# EasyEDA schematic 1-Schematic_CessnaCitationX_PilotBoard.json
TITLE: PILOT PANEL; REV: 2.0; Date: 2018-11-17; Sheet: 1/1; Drawn By: F-ORKI
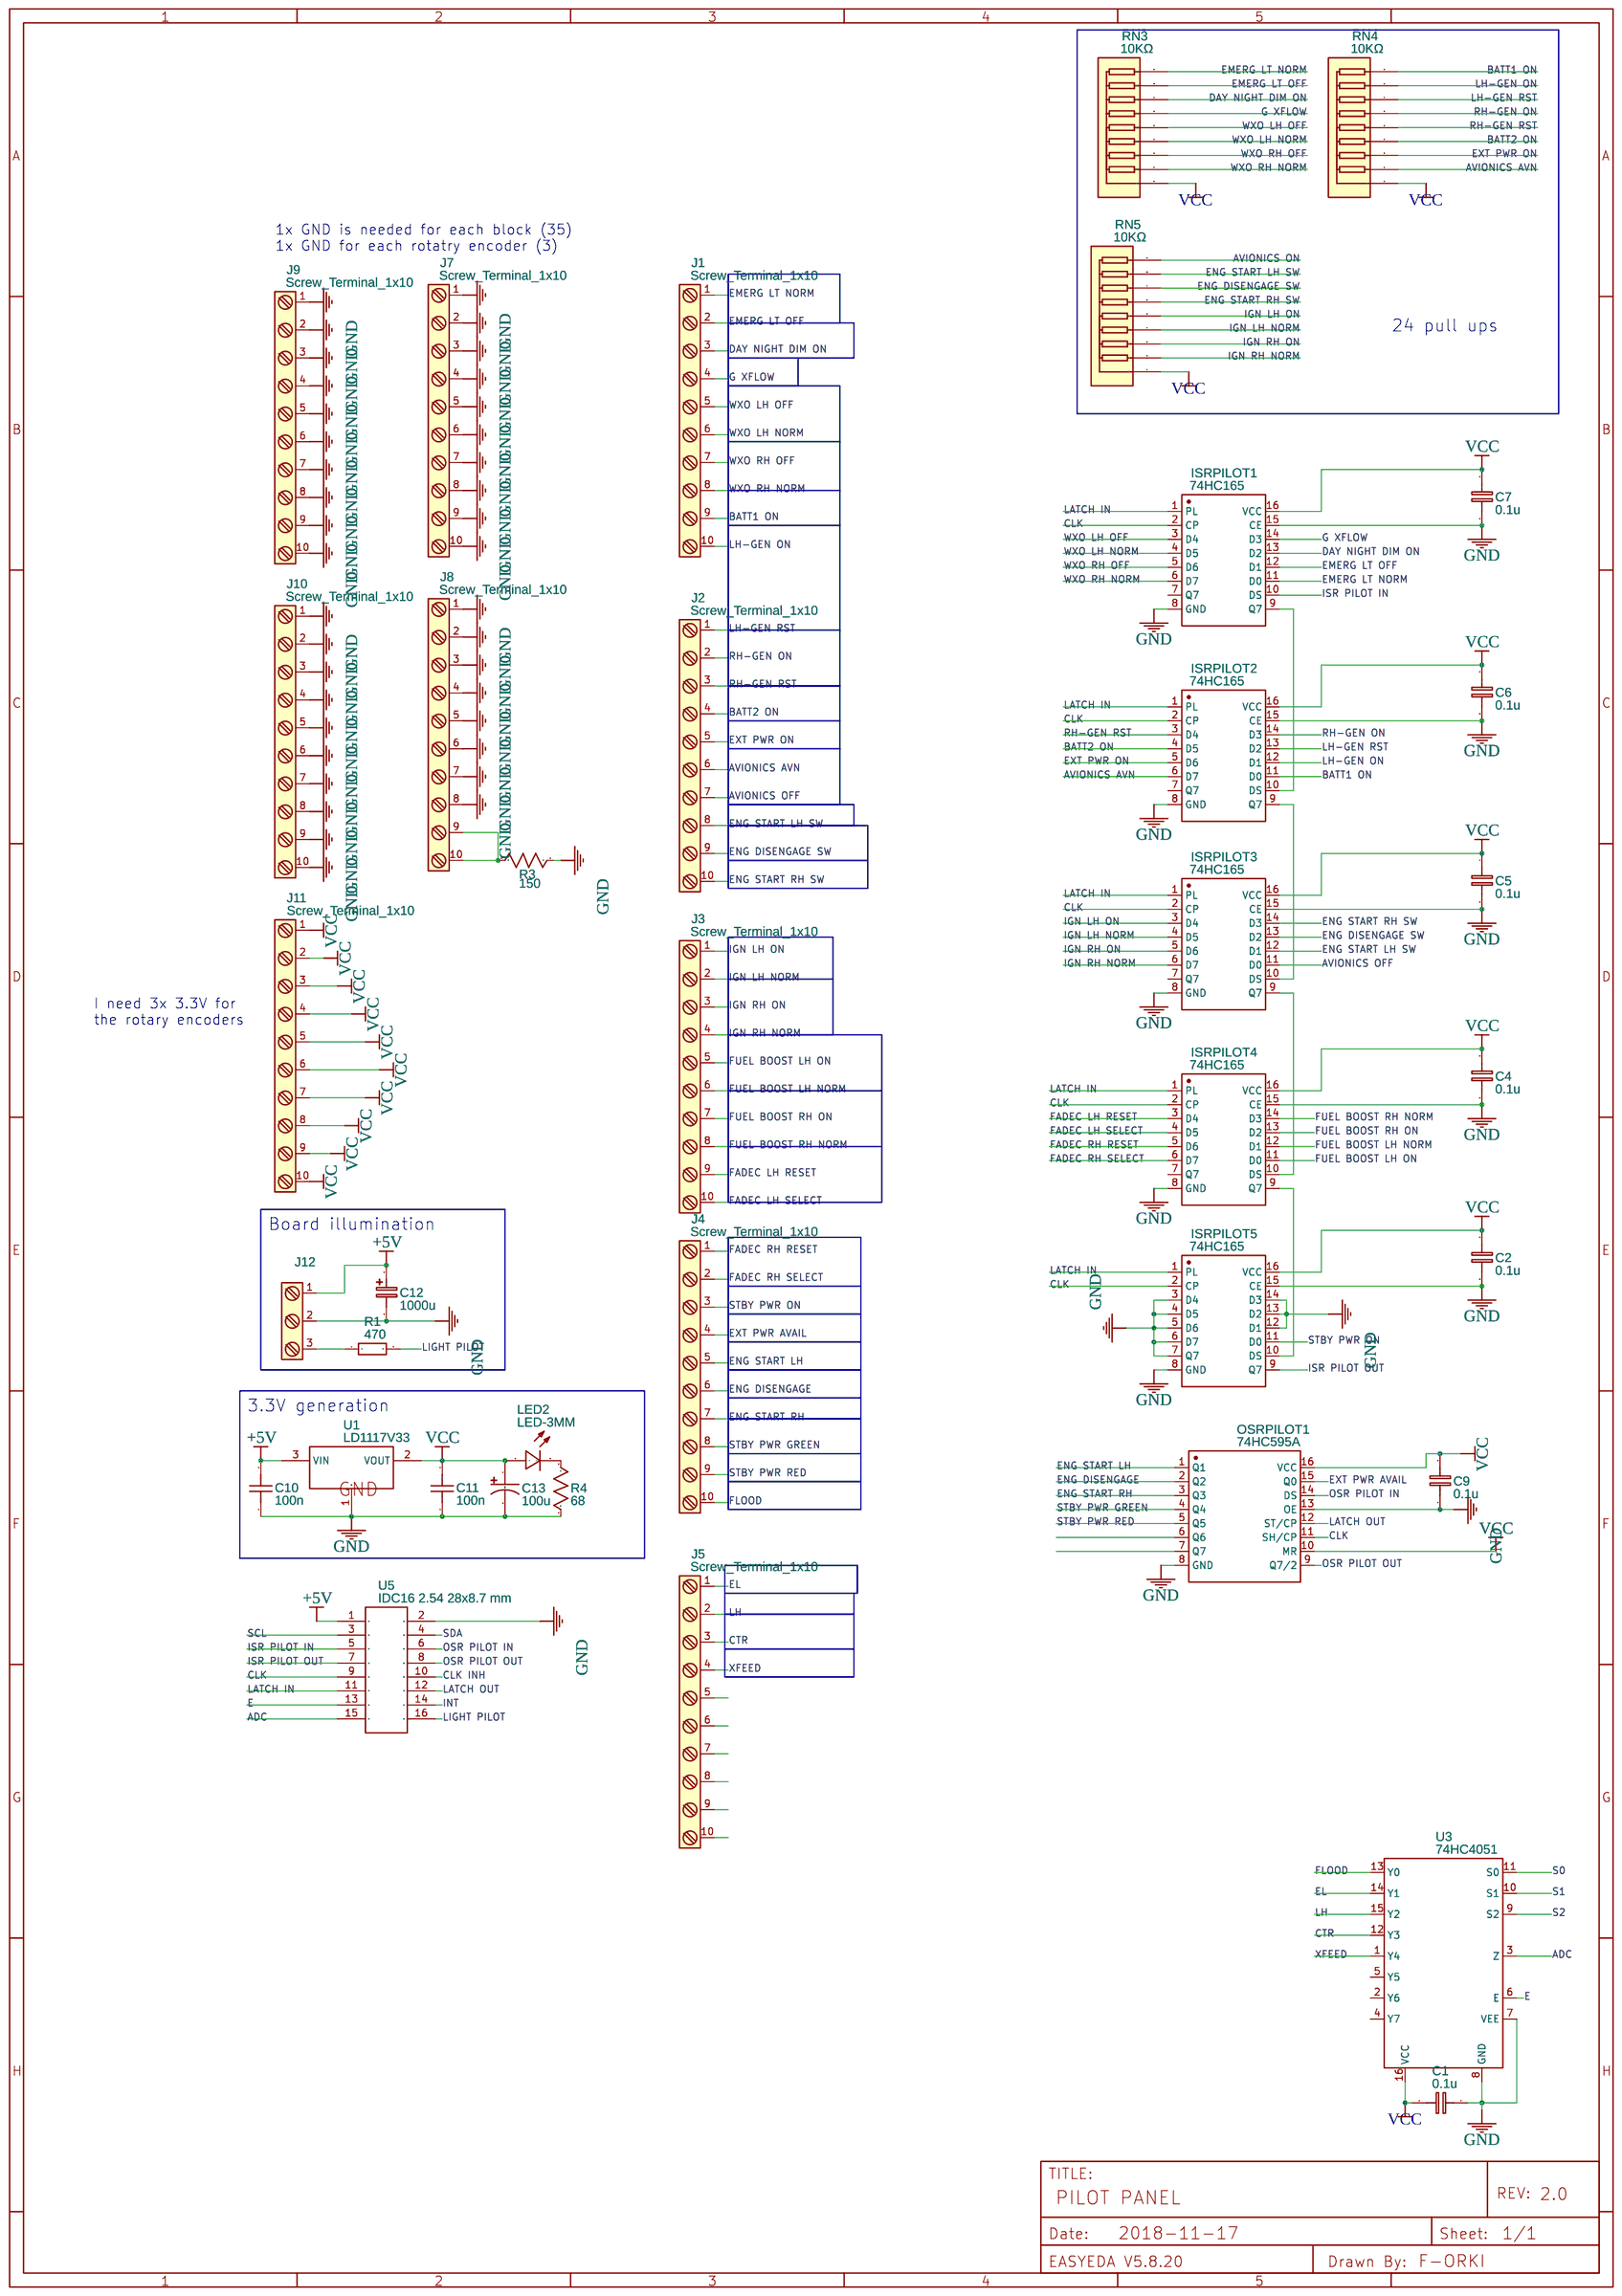
[diagram p0: schematic sheet]

## Parts
C1  0.1u  [RAD-0.1]
C2  0.1u  [RAD-0.1]
C4  0.1u  [RAD-0.1]
C5  0.1u  [RAD-0.1]
C6  0.1u  [RAD-0.1]
C7  0.1u  [RAD-0.1]
C9  0.1u  [RAD-0.1]
C10  100n  [RAD-0.1]
C11  100n  [RAD-0.1]
C12  1000u  [CAP-D3.0XF1.5]
C13  100u  [CAP-D3.0XF1.5]
ISRPILOT1  74HC165  [DIP16]
ISRPILOT2  74HC165  [DIP16]
ISRPILOT3  74HC165  [DIP16]
ISRPILOT4  74HC165  [DIP16]
ISRPILOT5  74HC165  [DIP16]
J1  Screw_Terminal_1x10  [TERMINALBLOCK_PHEONIX_MPT-2.54MM_10POL]
J2  Screw_Terminal_1x10  [TERMINALBLOCK_PHEONIX_MPT-2.54MM_10POL]
J3  Screw_Terminal_1x10  [TERMINALBLOCK_PHEONIX_MPT-2.54MM_10POL]
J4  Screw_Terminal_1x10  [TERMINALBLOCK_PHEONIX_MPT-2.54MM_10POL]
J5  Screw_Terminal_1x10  [TERMINALBLOCK_PHEONIX_MPT-2.54MM_10POL]
J7  Screw_Terminal_1x10  [TERMINALBLOCK_PHEONIX_MPT-2.54MM_10POL]
J8  Screw_Terminal_1x10  [TERMINALBLOCK_PHEONIX_MPT-2.54MM_10POL]
J9  Screw_Terminal_1x10  [TERMINALBLOCK_PHEONIX_MPT-2.54MM_10POL]
J10  Screw_Terminal_1x10  [TERMINALBLOCK_PHEONIX_MPT-2.54MM_10POL]
J11  Screw_Terminal_1x10  [TERMINALBLOCK_PHEONIX_MPT-2.54MM_10POL]
J12  Screw_Terminal_1x03  [TERMINALBLOCK_PHEONIX_MPT-2.54MM_3POL]
LED2  LED-3MM  [LED-3MM/2.54]
OSRPILOT1  74HC595A  [DIP-16]
R1  470  [AXIAL-0.3]
R3  150  [AXIAL-0.3]
R4  68  [AXIAL-0.3]
RN3  10KΩ  [SIP-9]
RN4  10KΩ  [SIP-9]
RN5  10KΩ  [SIP-9]
U1  LD1117V33  [TO-220(TO-220-3)]
U3  74HC4051  [DIL16-O]
U5  IDC16 2.54 28x8.7 mm  [IDC16 2.54 28X8.7 MM]

## Library data of the parts
C1 C2 C4-C7 C9 = Cap_RAD-0.1_EU: Manufacturer Part: ?
C10 C11 = Cap_RAD-0.1_US: Manufacturer Part: ?
C12 = Cap_Electrolytic(TH)_D3.0XF1.5_EU: Contributor: EasyEDA; Manufacturer Part: ?
C13 = Cap_Electrolytic(TH)_D3.0XF1.5_US: Manufacturer Part: ?
ISRPILOT1-ISRPILOT4 = -: Supplier: LCSC; Manufacturer: Nexperia; Manufacturer Part: 74HC165D,653; LCSC Assembly: Yes; image: //image.lceda.cn/szlcsc/C5613.jpg; Contributor: LCSC; Supplier Part: C5613
ISRPILOT5 = -: Supplier: LCSC; Manufacturer: Nexperia; Manufacturer Part: 74HC165D,653; LCSC Assembly: Yes; image: //image.lceda.cn/szlcsc/C5613.jpg; Contributor: LCSC; Supplier Part: C5613; Package Display: No
J1-J5 J7-J12 = -: Contributor: KiCAD; license: https://www.gnu.org/licenses/lgpl-2.1.html; Manufacturer Part: ?
LED2 = -: Supplier: LCSC; Manufacturer: EVERLIGHT; Manufacturer Part: 204-10SURD/S530-A3; Supplier Part: C99772
OSRPILOT1 = -: Supplier: LCSC; Manufacturer: FM; Contributor: LCSC; Supplier Part: C110383
R1 = Res_AXIAL-0.3(1/8W)_EU: Manufacturer Part: ?
R3 R4 = Res_AXIAL-0.3(1/8W)_US: Manufacturer Part: ?
RN3-RN5 = A09-103JP: Supplier: LCSC; Manufacturer: FH; Contributor: LCSC; Supplier Part: C8692
U1 = -: Supplier: LCSC; Supplier Part: C283467; Manufacturer: STMicroelectronics; Contributor: LCSC
U3 = -: Contributor: Ftec; Manufacturer Part: ?
U5 = -: Manufacturer Part: ?; Contributor: julien.pitault.1984

## Nets
+5V: C10.2 C12.1 J12.1 U1.3(VIN) U5.1(P1)
GND: C1.1 C2.2 C4.2 C5.2 C6.2 C7.2 C9.2 C10.1 C11.1 C12.2 C13.2 ISRPILOT1.8(GND) ISRPILOT1.15(CE) ISRPILOT2.8(GND) ISRPILOT2.15(CE) ISRPILOT3.8(GND) ISRPILOT3.15(CE) ISRPILOT4.8(GND) ISRPILOT4.15(CE) ISRPILOT5.3(D4) ISRPILOT5.4(D5) ISRPILOT5.5(D6) ISRPILOT5.6(D7) ISRPILOT5.7(Q7) ISRPILOT5.8(GND) ISRPILOT5.12(D1) ISRPILOT5.13(D2) ISRPILOT5.14(D3) ISRPILOT5.15(CE) J7.1 J7.2 J7.3 J7.4 J7.5 J7.6 J7.7 J7.8 J7.9 J7.10 J8.1 J8.2 J8.3 J8.4 J8.5 J8.6 J8.7 J8.8 J9.1 J9.2 J9.3 J9.4 J9.5 J9.6 J9.7 J9.8 J9.9 J9.10 J10.1 J10.2 J10.3 J10.4 J10.5 J10.6 J10.7 J10.8 J10.9 J10.10 J12.2 OSRPILOT1.8(GND) OSRPILOT1.13(OE) R3.1 R4.2 U1.1(GND) U3.7(VEE) U3.8(GND) U5.2(P2)
VCC: C1.2 C2.1 C4.1 C5.1 C6.1 C7.1 C9.1 C11.2 C13.1 ISRPILOT1.16(VCC) ISRPILOT2.16(VCC) ISRPILOT3.16(VCC) ISRPILOT4.16(VCC) ISRPILOT5.16(VCC) J11.1 J11.2 J11.3 J11.4 J11.5 J11.6 J11.7 J11.8 J11.9 J11.10 LED2.1(+) OSRPILOT1.10(MR) OSRPILOT1.16(VCC) RN3.1 RN4.1 RN5.1 U1.2(VOUT) U3.16(VCC)
ADC: U3.3(Z) U5.15
AVIONICS AVN: ISRPILOT2.6(D7) J2.6 RN4.2
AVIONICS OFF: ISRPILOT3.11(D0) J2.7
AVIONICS ON: RN5.9
BATT1 ON: ISRPILOT2.11(D0) J1.9 RN4.9
BATT2 ON: ISRPILOT2.4(D5) J2.4 RN4.4
CLK: ISRPILOT1.2(CP) ISRPILOT2.2(CP) ISRPILOT3.2(CP) ISRPILOT4.2(CP) ISRPILOT5.2(CP) OSRPILOT1.11(SH/CP) U5.9(P9)
CLK INH: U5.10(P10)
CTR: J5.3 U3.12(Y3)
DAY NIGHT DIM ON: ISRPILOT1.13(D2) J1.3 RN3.7
E: U3.6(E) U5.13
EL: J5.1 U3.14(Y1)
EMERG LT NORM: ISRPILOT1.11(D0) J1.1 RN3.9
EMERG LT OFF: ISRPILOT1.12(D1) J1.2 RN3.8
ENG DISENGAGE: J4.6 OSRPILOT1.2(Q2)
ENG DISENGAGE SW: ISRPILOT3.13(D2) J2.9 RN5.7
ENG START LH: J4.5 OSRPILOT1.1(Q1)
ENG START LH SW: ISRPILOT3.12(D1) J2.8 RN5.8
ENG START RH: J4.7 OSRPILOT1.3(Q3)
ENG START RH SW: ISRPILOT3.14(D3) J2.10 RN5.6
EXT PWR AVAIL: J4.4 OSRPILOT1.15(Q0)
EXT PWR ON: ISRPILOT2.5(D6) J2.5 RN4.3
FADEC LH RESET: ISRPILOT4.3(D4) J3.9
FADEC LH SELECT: ISRPILOT4.4(D5) J3.10
FADEC RH RESET: ISRPILOT4.5(D6) J4.1
FADEC RH SELECT: ISRPILOT4.6(D7) J4.2
FLOOD: J4.10 U3.13(Y0)
FUEL BOOST LH NORM: ISRPILOT4.12(D1) J3.6
FUEL BOOST LH ON: ISRPILOT4.11(D0) J3.5
FUEL BOOST RH NORM: ISRPILOT4.14(D3) J3.8
FUEL BOOST RH ON: ISRPILOT4.13(D2) J3.7
G XFLOW: ISRPILOT1.14(D3) J1.4 RN3.6
IGN LH NORM: ISRPILOT3.4(D5) J3.2 RN5.4
IGN LH ON: ISRPILOT3.3(D4) J3.1 RN5.5
IGN RH NORM: ISRPILOT3.6(D7) J3.4 RN5.2
IGN RH ON: ISRPILOT3.5(D6) J3.3 RN5.3
INT: U5.14
ISR PILOT IN: ISRPILOT1.10(DS) U5.5(P5)
ISR PILOT OUT: ISRPILOT5.9(Q7) U5.7(P7)
LATCH IN: ISRPILOT1.1(PL) ISRPILOT2.1(PL) ISRPILOT3.1(PL) ISRPILOT4.1(PL) ISRPILOT5.1(PL) U5.11
LATCH OUT: OSRPILOT1.12(ST/CP) U5.12
LH: J5.2 U3.15(Y2)
LH-GEN ON: ISRPILOT2.12(D1) J1.10 RN4.8
LH-GEN RST: ISRPILOT2.13(D2) J2.1 RN4.7
LIGHT PILOT: R1.2 U5.16
OSR PILOT IN: OSRPILOT1.14(DS) U5.6(P6)
OSR PILOT OUT: OSRPILOT1.9(Q7/2) U5.8(P8)
RH-GEN ON: ISRPILOT2.14(D3) J2.2 RN4.6
RH-GEN RST: ISRPILOT2.3(D4) J2.3 RN4.5
S0: U3.11(S0)
S1: U3.10(S1)
S2: U3.9(S2)
SCL: U5.3(P3)
SDA: U5.4(P4)
STBY PWR GREEN: J4.8 OSRPILOT1.4(Q4)
STBY PWR ON: ISRPILOT5.11(D0) J4.3
STBY PWR RED: J4.9 OSRPILOT1.5(Q5)
WXO LH NORM: ISRPILOT1.4(D5) J1.6 RN3.4
WXO LH OFF: ISRPILOT1.3(D4) J1.5 RN3.5
WXO RH NORM: ISRPILOT1.6(D7) J1.8 RN3.2
WXO RH OFF: ISRPILOT1.5(D6) J1.7 RN3.3
XFEED: J5.4 U3.1(Y4)
ISRPILOT1_9: ISRPILOT1.9(Q7) ISRPILOT2.10(DS)
ISRPILOT2_9: ISRPILOT2.9(Q7) ISRPILOT3.10(DS)
ISRPILOT3_9: ISRPILOT3.9(Q7) ISRPILOT4.10(DS)
ISRPILOT4_9: ISRPILOT4.9(Q7) ISRPILOT5.10(DS)
J8_9: J8.9 J8.10 R3.2
J12_3: J12.3 R1.1
R4_1: LED2.2(-) R4.1

Not connected (* = marked no-connect by the designer): ISRPILOT1 7(Q7); ISRPILOT2 7(Q7); ISRPILOT3 7(Q7); ISRPILOT4 7(Q7); J5 5 6 7 8 9 10; OSRPILOT1 6(Q6) 7(Q7); U3 2(Y6) 4(Y7) 5(Y5)

## Notes on the sheet
- 1x GND is needed for each block (35)
  1x GND for each rotatry encoder (3)
- 24 pull ups
- I need 3x 3.3V for
  the rotary encoders
- Board illumination
- 3.3V generation
